# EAGLE design Bottom Board (EAGLE 7.1.0)
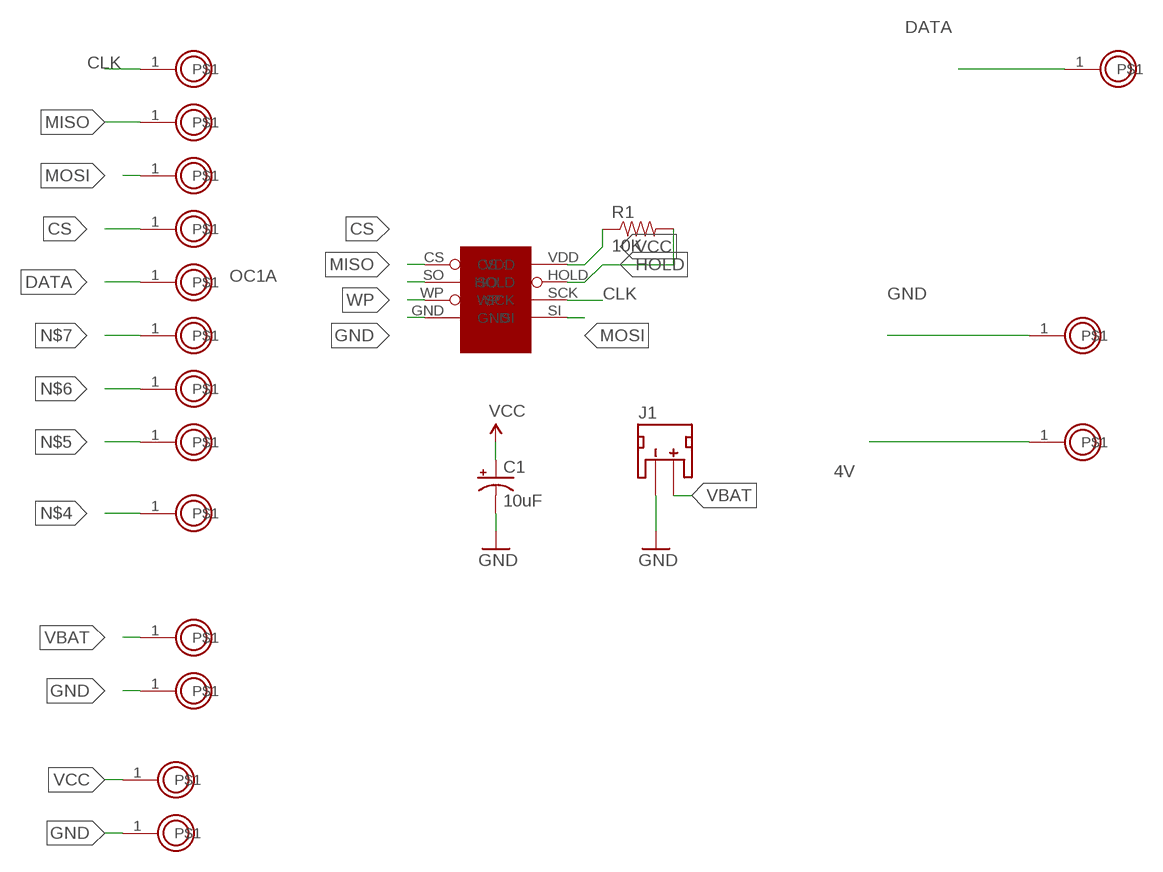
[diagram p0: schematic, sheet 1]

## Parts
0  PROTO_POINT  [1X01]
1  PROTO_POINT  [1X01]
2  PROTO_POINT  [1X01]
3  PROTO_POINT  [1X01]
4  PROTO_POINT  [1X01]
4V  PROTO_POINT  [1X01]
5  PROTO_POINT  [1X01]
A0  PROTO_POINT  [1X01]
A1  PROTO_POINT  [1X01]
BAT  PROTO_POINT  [1X01]
C1  10uF  10UF-16V-10%(TANT)  [EIA3216]
DATA  PROTO_POINT  [1X01]
FRAM  MB85RS64V  [SO08]
GND@1  PROTO_POINT  [1X01]
GND@2  PROTO_POINT  [1X01]
GND@3  PROTO_POINT  [1X01]
J1  JST_2MM_MALE  [JST-2-SMD]
R1  10K  10KOHM-1/10W-1%(0603)0603  [0603-RES]
RESET  PROTO_POINT  [1X01]
VCC  PROTO_POINT  [1X01]

## Nets
4V: 4V.1
CLK: 5.1 FRAM.SCK
CS: 2.1 FRAM.CS
DATA: 1.1 DATA.1
GND: C1.C(-) FRAM.GND GND@1.1 GND@2.1 GND@3.1 J1.1(-)
HOLD: FRAM.HOLD R1.2
MISO: 4.1 FRAM.SO
MOSI: 3.1 FRAM.SI
N$4: RESET.1
N$5: A0.1
N$6: A1.1
N$7: 0.1
VBAT: BAT.1 J1.2(+)
VCC: C1.A(+) FRAM.VDD R1.1 VCC.1
WP: FRAM.WP
Unconnected: J1.NC1(PAD1) J1.NC2(PAD2)

## Notes on the sheet
- OC1A

## Library data of the parts
0 1-4 4V 5 A0 A1 BAT DATA GND@1-GND@3 RESET VCC = BLEduino Bean:PROTO_POINT
C1 = SparkFun-Capacitors:10UF-16V-10%(TANT): CAP-00811 1206/EIA-3216 Tantalum capacitor; PROD_ID: CAP-00811
FRAM = radiationbean:MB85RS64V
J1 = SparkFun-Connectors:JST_2MM_MALE: Mates to single-cell LiPo batteries. CONN-08352; PROD_ID: CONN-08352
R1 = SparkFun-Resistors:10KOHM-1/10W-1%(0603): RES-00824; PROD_ID: RES-00824

## Board
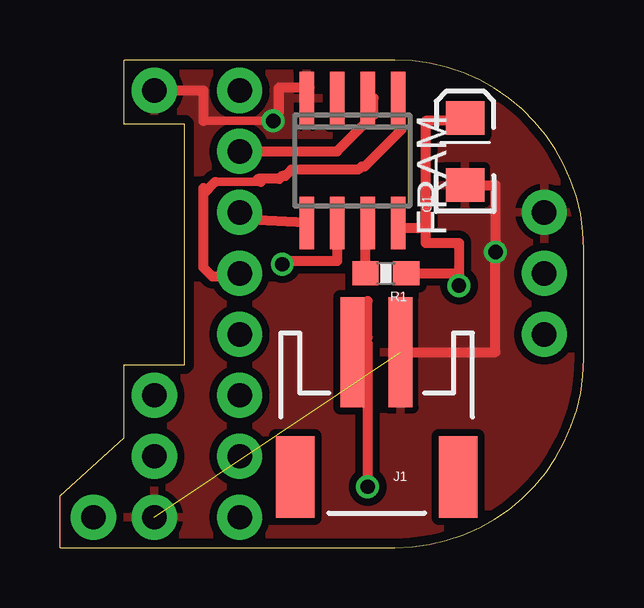
[diagram p1: board, top side]
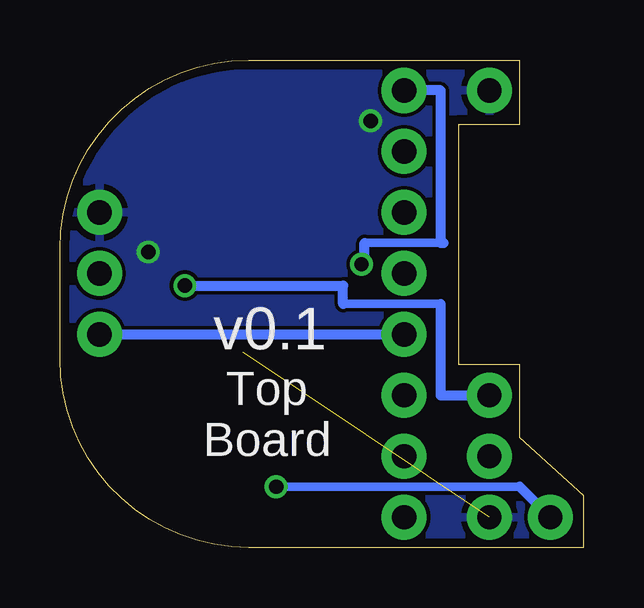
[diagram p2: board, bottom side, seen from below]

Size 21.84 x 20.32 mm. Coordinates in mm from the lower left corner, seen from the top.
Outline: 0,0 13.97,0 arc90 21.84,7.87 21.84,12.45 arc90 13.97,20.32 2.67,20.32 2.67,17.65 5.21,17.65 5.21,7.62 2.67,7.62 2.67,4.57 0,2.16 0,0
Copper layers (1*16): Top 0.0356mm / dielectric 1.5011mm / Bottom 0.0356mm
Design rules "oshPark": minimum track width 6mil, minimum drill 13mil, track to track 6mil, track to pad 6mil, pad to pad 6mil, via to via 6mil, smd to smd 6mil, copper to edge 15mil, drill to drill 6mil, minimum pad ring 7mil, minimum via ring 7mil, stop-mask expansion 3mil, vias tented up to drill 0mil, thermal gap 10mil

### Footprints (pad centres in the part's own frame; a part is rotated, then mirrored left to right if it is on the bottom)
1X01 = drill 1.016 pad 1.88: 1 0,0
EIA3216 = smd 1.4 x 1.6: A 1.4,0; C -1.4,0
SO08 = smd 0.6 x 2.2: CS -1.905,-2.6; GND 1.905,-2.6; HOLD -0.635,2.6; SCK 0.635,2.6; SI 1.905,2.6; SO -0.635,-2.6; VDD -1.905,2.6; WP 0.635,-2.6
JST-2-SMD = smd 1 x 4.6: 1 -1,-3.7; 2 1,-3.7 | smd 1.6 x 3.4: NC1 -3.4,1.5; NC2 3.4,1.5
0603-RES = smd 1.1 x 1: 1 -0.85,0; 2 0.85,0

### Placement (x,y rotation side)
0  7.49,6.35 0 top
1  7.49,8.89 0 top
2  7.49,11.43 0 top
3  7.49,13.97 0 top
4  7.49,16.51 0 top
4V  20.19,11.43 0 top
5  7.49,19.05 0 top
A0  7.49,1.27 0 top
A1  7.49,3.81 0 top
BAT  1.4,1.27 0 top
C1  16.89,16.51 90 top
DATA  20.19,8.89 0 top
FRAM  12.19,16.13 180 top
GND@1  20.19,13.97 0 top
GND@2  3.94,1.27 0 top
GND@3  3.94,19.05 0 top
J1  13.21,4.45 180 top
R1  13.59,11.43 180 top
RESET  3.94,3.81 0 top
VCC  3.94,6.35 0 top

### Tracks (layer width: path | path; a pad name or v marks a point on that pad's centre or on a via)
CLK  (via drill 0.6)
  Top 0.406: 11.56,13.66 FRAM.SCK 11.56,11.94 9.27,11.94 v9.27,11.81
  Bottom 0.356: 9.14,12.7 5.97,12.7
  Bottom 0.406: v9.27,11.81 9.14,11.81 9.14,12.7 | 7.49,19.18 5.1 5.97,19.05 5.97,12.7 5.84,12.7
CS
  Top 0.356: 8.38,15.24 6.48,15.24
  Top 0.406: FRAM.CS 14.22,17.4 12.7,15.88 12.57,15.88 12.45,15.75 9.65,15.75 9.4,15.49 9.27,15.49 9.14,15.37 8.25,15.37 8.38,15.24 | 5.97,14.99 5.97,14.73 | 5.97,14.73 5.97,11.68 6.35,11.3 7.37,11.3 2.1 | 6.48,15.24 5.97,14.73
DATA
  Bottom 0.406: DATA.1 1.1
GND  (via drill 0.6)  (1 unrouted)
  Top 0.356: v8.89,17.78 5.97,17.78
  Top 0.406: GND@3.1 5.97,19.05 5.97,17.78 | v8.89,17.78 9.14,17.78 9.14,19.18 10.41,19.18 FRAM.GND | J1.1 18.16,8.14 v18.16,12.32 18.16,15.11 C1.C
  pour Top (isolate 0.305): 13.97,20.32 arc-90 21.72,12.45 arc-90 21.84,12.45 21.84,7.87 arc-90 13.97,0 0,0 0,2.16 2.67,4.57 2.67,7.62 5.21,7.62 5.21,17.65 2.67,17.65 2.67,20.32
  pour Bottom: 2.67,17.53 2.67,20.32 13.97,20.32 arc-90 21.84,12.45 21.84,7.87 arc-90 13.97,0 0,0 0,2.16 2.67,4.57 2.67,7.62 5.21,7.62 5.21,17.65 arc90 4.95,17.78 3.18,17.78 arc90 2.92,17.53
HOLD
  Top 0.406: R1.2 12.74,13.44 FRAM.HOLD
MISO
  Top 0.406: 4.1 11.56,16.51 13.08,18.03 13.08,18.73 FRAM.SO
MOSI
  Top 0.406: FRAM.SI 7.81,13.66 3.1
VBAT  (via drill 0.6)
  Top 0.406: 12.83,10.29 12.83,8.76 J1.2 | 12.83,8.51 J1.2 | 12.95,2.41 v12.83,2.54 12.83,8.38 J1.2
  Bottom 0.356: v12.83,2.54 2.67,2.54
  Bottom 0.406: 2.67,2.54 BAT.1
VCC  (via drill 0.6)
  Top 0.406: FRAM.VDD 14.22,13.34 15.24,13.34 | C1.A 16.76,17.78 15.24,17.78 15.24,13.34 | R1.1 16.64,11.43 v16.64,10.92 16.64,12.7 15.24,12.7 15.24,13.34
  Bottom 0.356: 5.97,10.16 10.03,10.16
  Bottom 0.406: v16.64,10.92 10.03,10.92 10.03,10.16 | VCC.1 5.97,6.35 5.97,10.16

### Text on the board
_bsilk: v0.1 | Top / Board